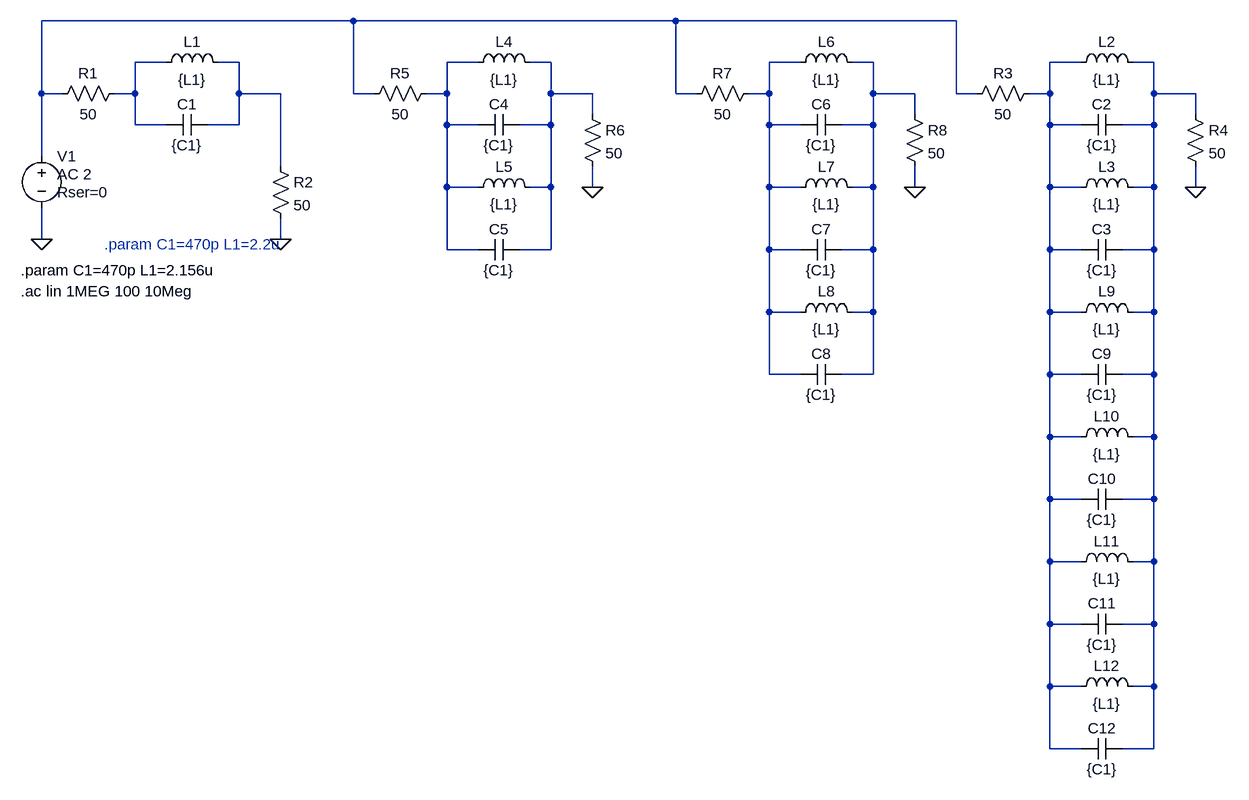
[diagram p0: schematic Draft5.asc]
Draft5.asc, the LTspice schematic file:
Version 4
SHEET 1 1240 928
WIRE -112 -336 -592 -336
WIRE 384 -336 -112 -336
WIRE 816 -336 384 -336
WIRE -400 -272 -448 -272
WIRE -288 -272 -320 -272
WIRE 80 -272 32 -272
WIRE 192 -272 160 -272
WIRE 576 -272 528 -272
WIRE 688 -272 656 -272
WIRE 1008 -272 960 -272
WIRE 1120 -272 1088 -272
WIRE -592 -224 -592 -336
WIRE -560 -224 -592 -224
WIRE -448 -224 -448 -272
WIRE -448 -224 -480 -224
WIRE -288 -224 -288 -272
WIRE -224 -224 -288 -224
WIRE -112 -224 -112 -336
WIRE -80 -224 -112 -224
WIRE 32 -224 32 -272
WIRE 32 -224 0 -224
WIRE 192 -224 192 -272
WIRE 256 -224 192 -224
WIRE 384 -224 384 -336
WIRE 416 -224 384 -224
WIRE 528 -224 528 -272
WIRE 528 -224 496 -224
WIRE 688 -224 688 -272
WIRE 752 -224 688 -224
WIRE 816 -224 816 -336
WIRE 848 -224 816 -224
WIRE 960 -224 960 -272
WIRE 960 -224 928 -224
WIRE 1120 -224 1120 -272
WIRE 1184 -224 1120 -224
WIRE 256 -192 256 -224
WIRE 752 -192 752 -224
WIRE 1184 -192 1184 -224
WIRE -448 -176 -448 -224
WIRE -400 -176 -448 -176
WIRE -288 -176 -288 -224
WIRE -288 -176 -336 -176
WIRE 32 -176 32 -224
WIRE 80 -176 32 -176
WIRE 192 -176 192 -224
WIRE 192 -176 144 -176
WIRE 528 -176 528 -224
WIRE 576 -176 528 -176
WIRE 688 -176 688 -224
WIRE 688 -176 640 -176
WIRE 960 -176 960 -224
WIRE 1008 -176 960 -176
WIRE 1120 -176 1120 -224
WIRE 1120 -176 1072 -176
WIRE -592 -128 -592 -224
WIRE -224 -112 -224 -224
WIRE 32 -80 32 -176
WIRE 80 -80 32 -80
WIRE 192 -80 192 -176
WIRE 192 -80 160 -80
WIRE 256 -80 256 -112
WIRE 528 -80 528 -176
WIRE 576 -80 528 -80
WIRE 688 -80 688 -176
WIRE 688 -80 656 -80
WIRE 752 -80 752 -112
WIRE 960 -80 960 -176
WIRE 1008 -80 960 -80
WIRE 1120 -80 1120 -176
WIRE 1120 -80 1088 -80
WIRE 1184 -80 1184 -112
WIRE -592 0 -592 -48
WIRE -224 0 -224 -32
WIRE 32 16 32 -80
WIRE 80 16 32 16
WIRE 192 16 192 -80
WIRE 192 16 144 16
WIRE 528 16 528 -80
WIRE 576 16 528 16
WIRE 688 16 688 -80
WIRE 688 16 640 16
WIRE 960 16 960 -80
WIRE 1008 16 960 16
WIRE 1120 16 1120 -80
WIRE 1120 16 1072 16
WIRE 528 112 528 16
WIRE 576 112 528 112
WIRE 688 112 688 16
WIRE 688 112 656 112
WIRE 960 112 960 16
WIRE 1008 112 960 112
WIRE 1120 112 1120 16
WIRE 1120 112 1088 112
WIRE 528 208 528 112
WIRE 576 208 528 208
WIRE 688 208 688 112
WIRE 688 208 640 208
WIRE 960 208 960 112
WIRE 1008 208 960 208
WIRE 1120 208 1120 112
WIRE 1120 208 1072 208
WIRE 960 304 960 208
WIRE 1008 304 960 304
WIRE 1120 304 1120 208
WIRE 1120 304 1088 304
WIRE 960 400 960 304
WIRE 1008 400 960 400
WIRE 1120 400 1120 304
WIRE 1120 400 1072 400
WIRE 960 496 960 400
WIRE 1008 496 960 496
WIRE 1120 496 1120 400
WIRE 1120 496 1088 496
WIRE 960 592 960 496
WIRE 1008 592 960 592
WIRE 1120 592 1120 496
WIRE 1120 592 1072 592
WIRE 960 688 960 592
WIRE 1008 688 960 688
WIRE 1120 688 1120 592
WIRE 1120 688 1088 688
WIRE 960 784 960 688
WIRE 1008 784 960 784
WIRE 1120 784 1120 688
WIRE 1120 784 1072 784
FLAG -592 0 0
FLAG -224 0 0
FLAG 256 -80 0
FLAG 752 -80 0
FLAG 1184 -80 0
SYMBOL voltage -592 -144 R0
WINDOW 3 24 44 Left 2
WINDOW 123 24 44 Left 2
WINDOW 39 24 72 Left 2
SYMATTR Value ""
SYMATTR Value2 AC 2
SYMATTR SpiceLine Rser=0
SYMATTR InstName V1
SYMBOL res -576 -208 R270
WINDOW 0 32 56 VTop 2
WINDOW 3 0 56 VBottom 2
SYMATTR InstName R1
SYMATTR Value 50
SYMBOL cap -336 -192 R90
WINDOW 0 0 32 VBottom 2
WINDOW 3 32 32 VTop 2
SYMATTR InstName C1
SYMATTR Value {C1}
SYMBOL ind -416 -256 R270
WINDOW 0 32 56 VTop 2
WINDOW 3 5 56 VBottom 2
SYMATTR InstName L1
SYMATTR Value {L1}
SYMATTR SpiceLine Rser=200m
SYMBOL res -240 -128 R0
SYMATTR InstName R2
SYMATTR Value 50
SYMBOL res -96 -208 R270
WINDOW 0 32 56 VTop 2
WINDOW 3 0 56 VBottom 2
SYMATTR InstName R5
SYMATTR Value 50
SYMBOL cap 144 -192 R90
WINDOW 0 0 32 VBottom 2
WINDOW 3 32 32 VTop 2
SYMATTR InstName C4
SYMATTR Value {C1}
SYMBOL ind 64 -256 R270
WINDOW 0 32 56 VTop 2
WINDOW 3 5 56 VBottom 2
SYMATTR InstName L4
SYMATTR Value {L1}
SYMATTR SpiceLine Rser=200m
SYMBOL cap 144 0 R90
WINDOW 0 0 32 VBottom 2
WINDOW 3 32 32 VTop 2
SYMATTR InstName C5
SYMATTR Value {C1}
SYMBOL ind 64 -64 R270
WINDOW 0 32 56 VTop 2
WINDOW 3 5 56 VBottom 2
SYMATTR InstName L5
SYMATTR Value {L1}
SYMATTR SpiceLine Rser=200m
SYMBOL res 240 -208 R0
SYMATTR InstName R6
SYMATTR Value 50
SYMBOL res 400 -208 R270
WINDOW 0 32 56 VTop 2
WINDOW 3 0 56 VBottom 2
SYMATTR InstName R7
SYMATTR Value 50
SYMBOL cap 640 -192 R90
WINDOW 0 0 32 VBottom 2
WINDOW 3 32 32 VTop 2
SYMATTR InstName C6
SYMATTR Value {C1}
SYMBOL ind 560 -256 R270
WINDOW 0 32 56 VTop 2
WINDOW 3 5 56 VBottom 2
SYMATTR InstName L6
SYMATTR Value {L1}
SYMATTR SpiceLine Rser=200m
SYMBOL cap 640 0 R90
WINDOW 0 0 32 VBottom 2
WINDOW 3 32 32 VTop 2
SYMATTR InstName C7
SYMATTR Value {C1}
SYMBOL ind 560 -64 R270
WINDOW 0 32 56 VTop 2
WINDOW 3 5 56 VBottom 2
SYMATTR InstName L7
SYMATTR Value {L1}
SYMATTR SpiceLine Rser=200m
SYMBOL res 736 -208 R0
SYMATTR InstName R8
SYMATTR Value 50
SYMBOL cap 640 192 R90
WINDOW 0 0 32 VBottom 2
WINDOW 3 32 32 VTop 2
SYMATTR InstName C8
SYMATTR Value {C1}
SYMBOL ind 560 128 R270
WINDOW 0 32 56 VTop 2
WINDOW 3 5 56 VBottom 2
SYMATTR InstName L8
SYMATTR Value {L1}
SYMATTR SpiceLine Rser=200m
SYMBOL res 832 -208 R270
WINDOW 0 32 56 VTop 2
WINDOW 3 0 56 VBottom 2
SYMATTR InstName R3
SYMATTR Value 50
SYMBOL cap 1072 -192 R90
WINDOW 0 0 32 VBottom 2
WINDOW 3 32 32 VTop 2
SYMATTR InstName C2
SYMATTR Value {C1}
SYMBOL ind 992 -256 R270
WINDOW 0 32 56 VTop 2
WINDOW 3 5 56 VBottom 2
SYMATTR InstName L2
SYMATTR Value {L1}
SYMATTR SpiceLine Rser=200m
SYMBOL cap 1072 0 R90
WINDOW 0 0 32 VBottom 2
WINDOW 3 32 32 VTop 2
SYMATTR InstName C3
SYMATTR Value {C1}
SYMBOL ind 992 -64 R270
WINDOW 0 32 56 VTop 2
WINDOW 3 5 56 VBottom 2
SYMATTR InstName L3
SYMATTR Value {L1}
SYMATTR SpiceLine Rser=200m
SYMBOL res 1168 -208 R0
SYMATTR InstName R4
SYMATTR Value 50
SYMBOL cap 1072 192 R90
WINDOW 0 0 32 VBottom 2
WINDOW 3 32 32 VTop 2
SYMATTR InstName C9
SYMATTR Value {C1}
SYMBOL ind 992 128 R270
WINDOW 0 32 56 VTop 2
WINDOW 3 5 56 VBottom 2
SYMATTR InstName L9
SYMATTR Value {L1}
SYMATTR SpiceLine Rser=200m
SYMBOL cap 1072 384 R90
WINDOW 0 0 32 VBottom 2
WINDOW 3 32 32 VTop 2
SYMATTR InstName C10
SYMATTR Value {C1}
SYMBOL ind 992 320 R270
WINDOW 0 32 56 VTop 2
WINDOW 3 5 56 VBottom 2
SYMATTR InstName L10
SYMATTR Value {L1}
SYMATTR SpiceLine Rser=200m
SYMBOL cap 1072 576 R90
WINDOW 0 0 32 VBottom 2
WINDOW 3 32 32 VTop 2
SYMATTR InstName C11
SYMATTR Value {C1}
SYMBOL ind 992 512 R270
WINDOW 0 32 56 VTop 2
WINDOW 3 5 56 VBottom 2
SYMATTR InstName L11
SYMATTR Value {L1}
SYMATTR SpiceLine Rser=200m
SYMBOL cap 1072 768 R90
WINDOW 0 0 32 VBottom 2
WINDOW 3 32 32 VTop 2
SYMATTR InstName C12
SYMATTR Value {C1}
SYMBOL ind 992 704 R270
WINDOW 0 32 56 VTop 2
WINDOW 3 5 56 VBottom 2
SYMATTR InstName L12
SYMATTR Value {L1}
SYMATTR SpiceLine Rser=200m
TEXT -624 80 Left 2 !.ac lin 1MEG 100 10Meg
TEXT -624 48 Left 2 !.param C1=470p L1=2.156u
TEXT -496 8 Left 2 ;.param C1=470p L1=2.2u

The netlist it stands for:
* Draft5.asc
V1 N001 0 AC 2 Rser=0
R1 N001 N002 50
C1 N003 N002 {C1}
L1 N002 N003 {L1} Rser=200m
R2 N003 0 50
R5 N001 N004 50
C4 N005 N004 {C1}
L4 N004 N005 {L1} Rser=200m
C5 N005 N004 {C1}
L5 N004 N005 {L1} Rser=200m
R6 N005 0 50
R7 N001 N006 50
C6 N007 N006 {C1}
L6 N006 N007 {L1} Rser=200m
C7 N007 N006 {C1}
L7 N006 N007 {L1} Rser=200m
R8 N007 0 50
C8 N007 N006 {C1}
L8 N006 N007 {L1} Rser=200m
R3 N001 N008 50
C2 N009 N008 {C1}
L2 N008 N009 {L1} Rser=200m
C3 N009 N008 {C1}
L3 N008 N009 {L1} Rser=200m
R4 N009 0 50
C9 N009 N008 {C1}
L9 N008 N009 {L1} Rser=200m
C10 N009 N008 {C1}
L10 N008 N009 {L1} Rser=200m
C11 N009 N008 {C1}
L11 N008 N009 {L1} Rser=200m
C12 N009 N008 {C1}
L12 N008 N009 {L1} Rser=200m
.ac lin 1MEG 100 10Meg
.param C1=470p L1=2.156u
* .param C1=470p L1=2.2u
.backanno
.end